# EAGLE schematic Robomow_PCG5000G1 (EAGLE 9.6.2)
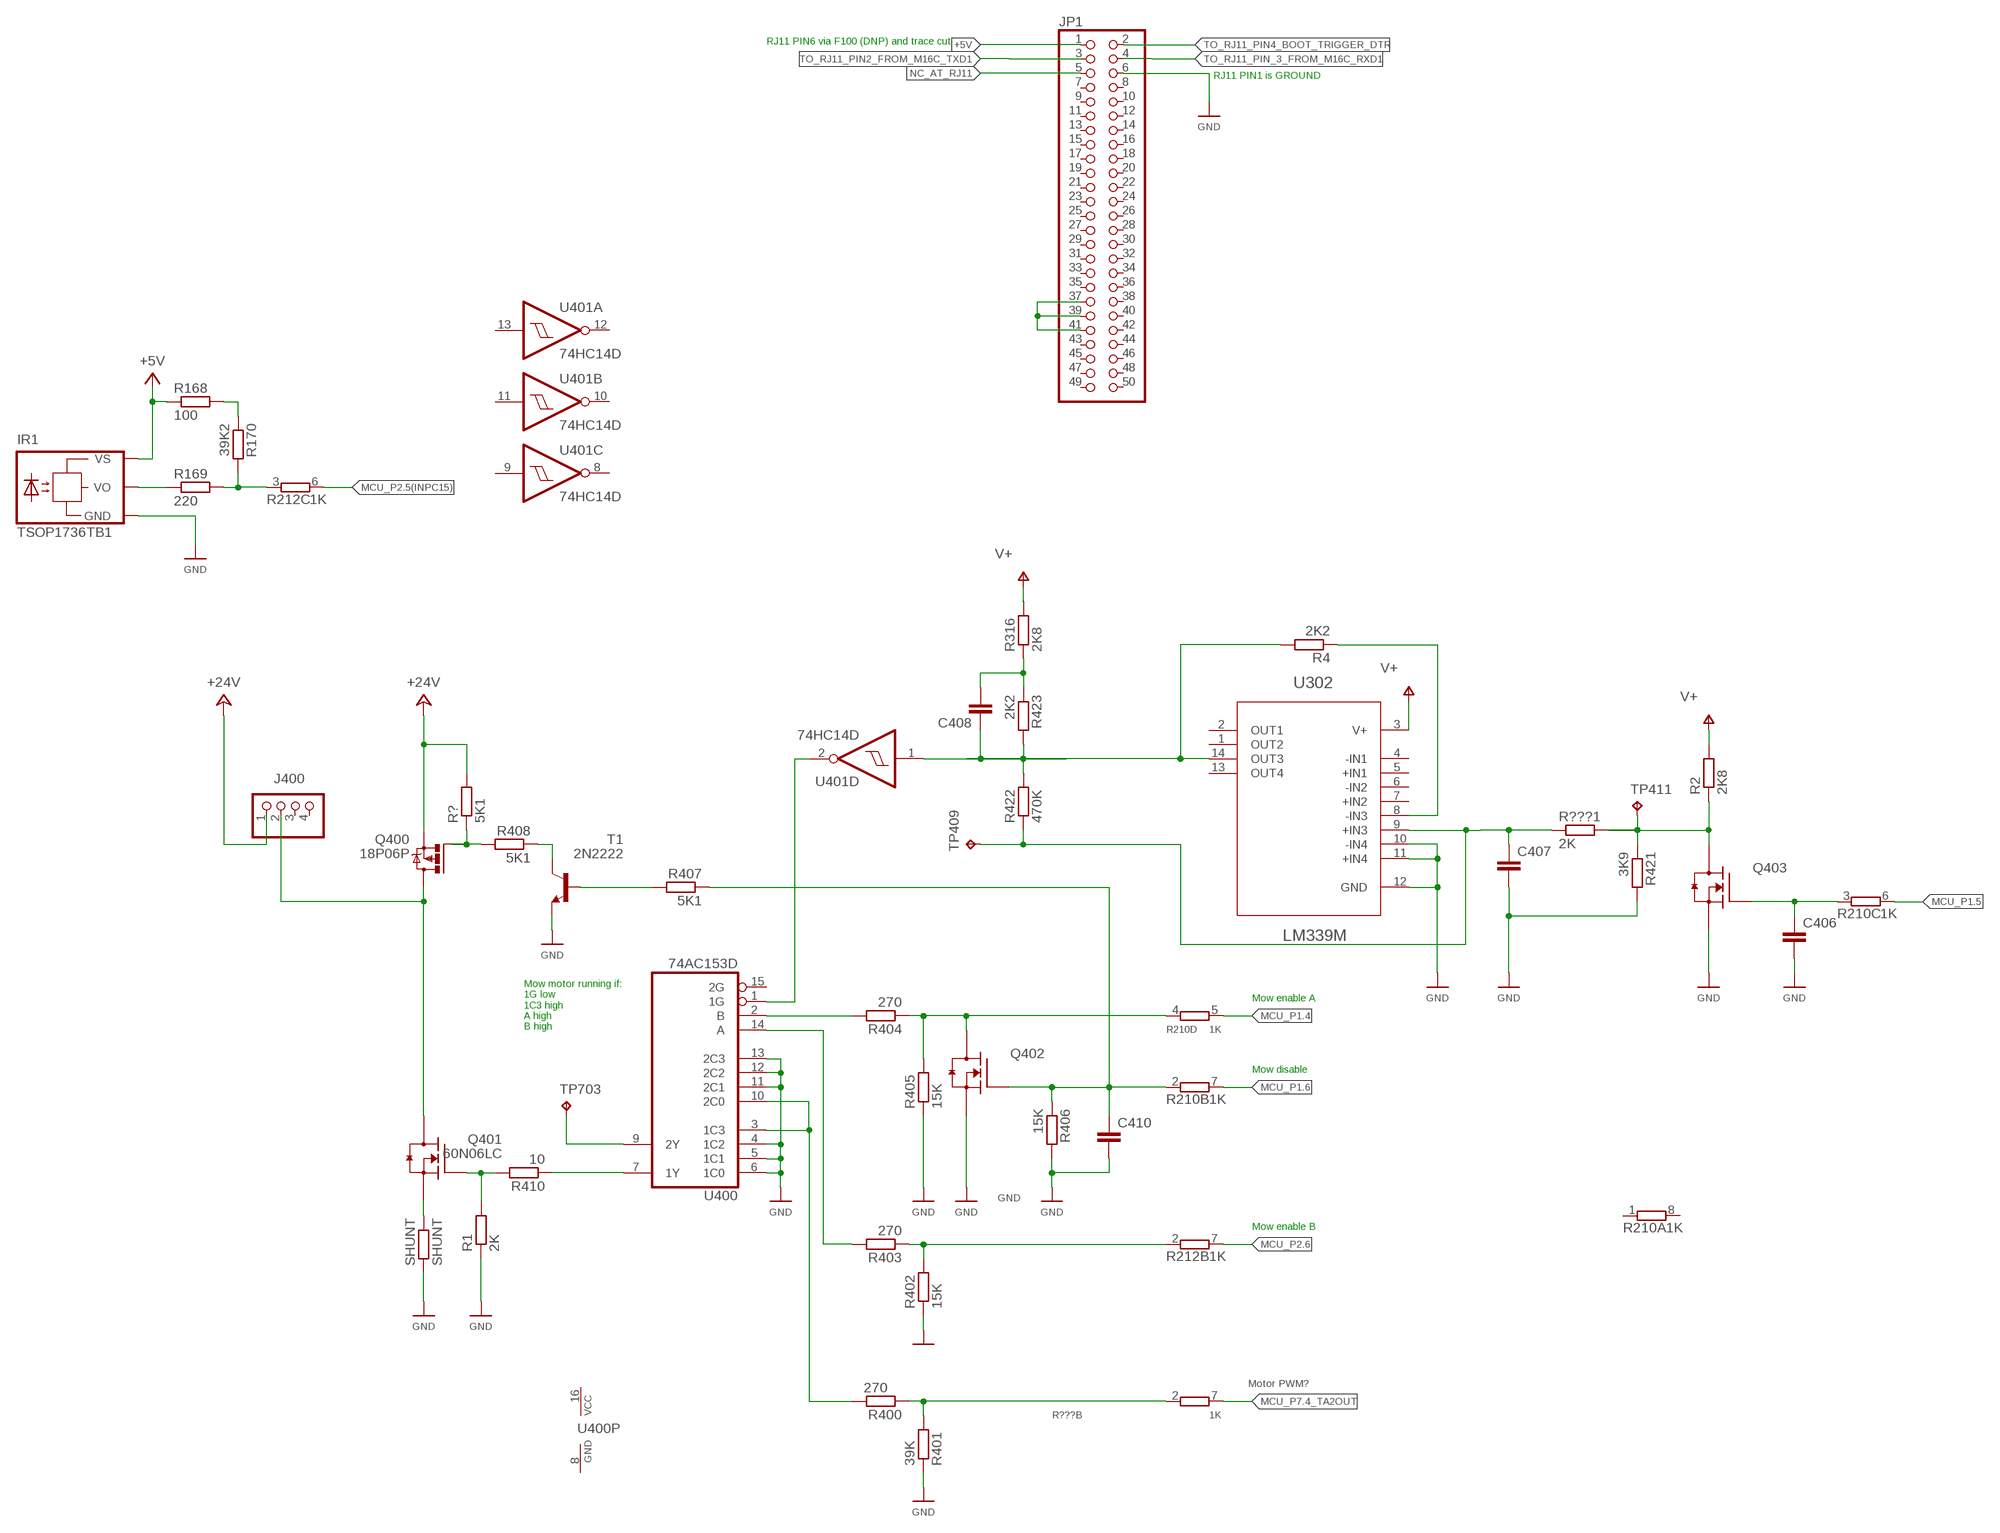
[diagram p0: schematic, sheet 1]

## Parts
C406  C-EUC0603  [C0603]
C407  C-EUC0603  [C0603]
C408  C-EUC0603  [C0603]
C410  C-EUC0603  [C0603]
IR1  TSOP1736TB1  [TSOP17_TB1]
J400  PINHD-1X4  [1X04]
JP1  PINHD-2X25  [2X25]
Q401  60N06LC  N-MOSFETDPACK  [DPACK]
Q402  N-MOSFETDPACK  [DPACK]
Q403  N-MOSFETDPACK  [DPACK]
R1  2K  R-EU_R0603  [R0603]
R2  2K8  R-EU_R0603  [R0603]
R4  2K2  R-EU_R0603  [R0603]
R168  100  R-EU_R0603  [R0603]
R169  220  R-EU_R0603  [R0603]
R170  39K2  R-EU_R0603  [R0603]
R210  1K  4R-NCAT16  [CAT16]
R212  1K  4R-NCAT16  [CAT16]
R316  2K8  R-EU_R0603  [R0603]
R400  270  R-EU_R0603  [R0603]
R401  39K  R-EU_R0603  [R0603]
R402  15K  R-EU_R0603  [R0603]
R403  270  R-EU_R0603  [R0603]
R404  270  R-EU_R0603  [R0603]
R405  15K  R-EU_R0603  [R0603]
R406  15K  R-EU_R0603  [R0603]
R407  5K1  R-EU_R0603  [R0603]
R408  5K1  R-EU_R0603  [R0603]
R410  10  R-EU_R0603  [R0603]
R421  3K9  R-EU_R0603  [R0603]
R422  470K  R-EU_R0603  [R0603]
R423  2K2  R-EU_R0603  [R0603]
R?  5K1  R-EU_R0603  [R0603]
R???  1K  4R-NCAT16  [CAT16]
R???1  2K  R-EU_R0603  [R0603]
SHUNT  SHUNT  R-EU_R0603  [R0603]
T1  2N2222  [TO92-EBC-OVAL]
TP409  TPB1,27  [B1,27]
TP411  TPB1,27  [B1,27]
TP703  TPB1,27  [B1,27]
U302  LM339M  [SOIC127P620X175-14N]
U400  74AC153D  [SO16]
U401  74HC14D  [SO14]

## Nets
+5V: IR1.VS JP1.1 R168.1
+24V: J400.1 R?.2
GND: C406.2 C407.2 C410.2 IR1.GND JP1.6 Q402.3(S) Q403.3(S) R1.1 R401.1 R402.1 R405.1 R406.2 R421.2 SHUNT.1 T1.E U302.10(-IN4) U302.11(+IN4) U302.12(GND) U400.4(1C2) U400.5(1C1) U400.6(1C0) U400.11(2C1) U400.12(2C2) U400.13(2C3)
MCU_P1.4: R210.5
MCU_P1.5: R210.6
MCU_P1.6: R210.7
MCU_P2.5(INPC15): R212.6
MCU_P2.6: R212.7
MCU_P7.4_TA2OUT: R???.7
MOTOR_HALT?: C410.1 Q402.1(G) R210.2 R406.1 R407.1
MOTOR_HALT?1: C406.1 Q403.1(G) R210.3
N$1: J400.2 Q401.2(D)
N$2: Q401.1(G) R1.2 R410.2
N$3: R410.1 U400.7(1Y)
N$4: R407.2 T1.B
N$5: C408.1 R4.2 R422.2 R423.2 U302.14(OUT3) U401.1(D:I)
N$6: TP703.TP U400.9(2Y)
N$7: R212.2 R402.2 R403.1
N$8: R169.2 R170.2 R212.3
N$9: R408.1 T1.C
N$10: R404.2 U400.2(B)
N$11: R403.2 U400.14(A)
N$12: R400.1 R401.2 R???.2
N$13: R400.2 U400.3(1C3) U400.10(2C0)
N$14: Q403.2(D) R2.1 R421.1 R???1.2 TP411.TP
N$15: U400.1(1G) U401.2(D:O)
N$16: Q401.3(S) SHUNT.2
N$17: Q402.2(D) R210.4 R404.1 R405.2
N$18: C408.2 R316.1 R423.1
N$19: JP1.37 JP1.39 JP1.41
N$20: R4.1 U302.8(-IN3)
N$21: C407.1 R422.1 R???1.1 TP409.TP U302.9(+IN3)
N$22: IR1.VO R169.1
N$24: R168.2 R170.1
NC_AT_RJ11: JP1.5
Q400_GATE: R408.2 R?.1
TO_RJ11_PIN2_FROM_M16C_TXD1: JP1.3
TO_RJ11_PIN4_BOOT_TRIGGER_DTR: JP1.2
TO_RJ11_PIN_3_FROM_M16C_RXD1: JP1.4
V+: R2.2 R316.2 U302.3(V+)
Unconnected: J400.3 J400.4 JP1.7 JP1.8 JP1.9 JP1.10 JP1.11 JP1.12 JP1.13 JP1.14 JP1.15 JP1.16 JP1.17 JP1.18 JP1.19 JP1.20 JP1.21 JP1.22 JP1.23 JP1.24 JP1.25 JP1.26 JP1.27 JP1.28 JP1.29 JP1.30 JP1.31 JP1.32 JP1.33 JP1.34 JP1.35 JP1.36 JP1.38 JP1.40 JP1.42 JP1.43 JP1.44 JP1.45 JP1.46 JP1.47 JP1.48 JP1.49 JP1.50 R210.1 R210.8 R212.1 R212.4 R212.5 R212.8 R???.1 R???.3 R???.4 R???.5 R???.6 R???.8 U302.1(OUT2) U302.2(OUT1) U302.4(-IN1) U302.5(+IN1) U302.6(-IN2) U302.7(+IN2) U302.13(OUT4) U400.15(2G) U401.3(E:I) U401.4(E:O) U401.5(F:I) U401.6(F:O) U401.8(C:O) U401.9(C:I) U401.10(B:O) U401.11(B:I) U401.12(A:O) U401.13(A:I)

## Notes on the sheet
- RJ11 PIN6 via F100 (DNP) and trace cut
- RJ11 PIN1 is GROUND
- Mow enable A
- Mow motor running if:
  1G low
  1C3 high
  A high
  B high
- Mow disable
- Mow enable B
- Motor PWM?

## Power pins joined to a net without a drawn wire
GND: U400.8(GND) U401.7(P:GND)
VCC: U400.16(VCC) U401.14(P:VCC)

## Library data of the parts
C406-C408 C410 = rcl:C-EU: CAPACITOR, European symbol
IR1 = telefunken:TSOP17*TB1: TSOP17..TB1 IR Receiver Modules for Remote Control Systems Source: http://www.vishay.com/docs/82042/82042.pdf; OC_FARNELL: unknown; OC_NEWARK: unknown
J400 = pinhead:PINHD-1X4: PIN HEADER
JP1 = pinhead:PINHD-2X25: PIN HEADER
Q401-Q403 = martonmiklos:N-MOSFET: N-CHANNEL MOS FET SYMBOL
R1 R2 R4 R168-R170 R316 R400-R408 R410 R421-R423 R? R???1 SHUNT = rcl:R-EU_: RESISTOR, European symbol
R210 R212 R??? = resistor-dil:4R-N: Array Chip Resistor Source: RS Component / Phycomp; NI_PN: 710156-01; OC_FARNELL: unknown; OC_NEWARK: unknown; OC_RET: 04-01-49
T1 = adafruit:2N2222: NPN TRANSISTOR Big oval pads
TP409 TP411 TP703 = testpad:TP: Test pad
U302 = NSC_By_element14_Batch_1.1:LM339M: Quad Comparators; MPN: LM339M; OC_FARNELL: 9487654; OC_NEWARK: -; PACKAGE: SOIC-14; SUPPLIER: National Semiconductor
U400 = 74xx-eu:74*153: Dual 4-line to 1-line data SELECTOR/MULTIPLEXER
U401 = 74xx-eu:74*14: Hex schmitt trigger INVERTER